# EAGLE design wctl_wifi (EAGLE 9.6.2)
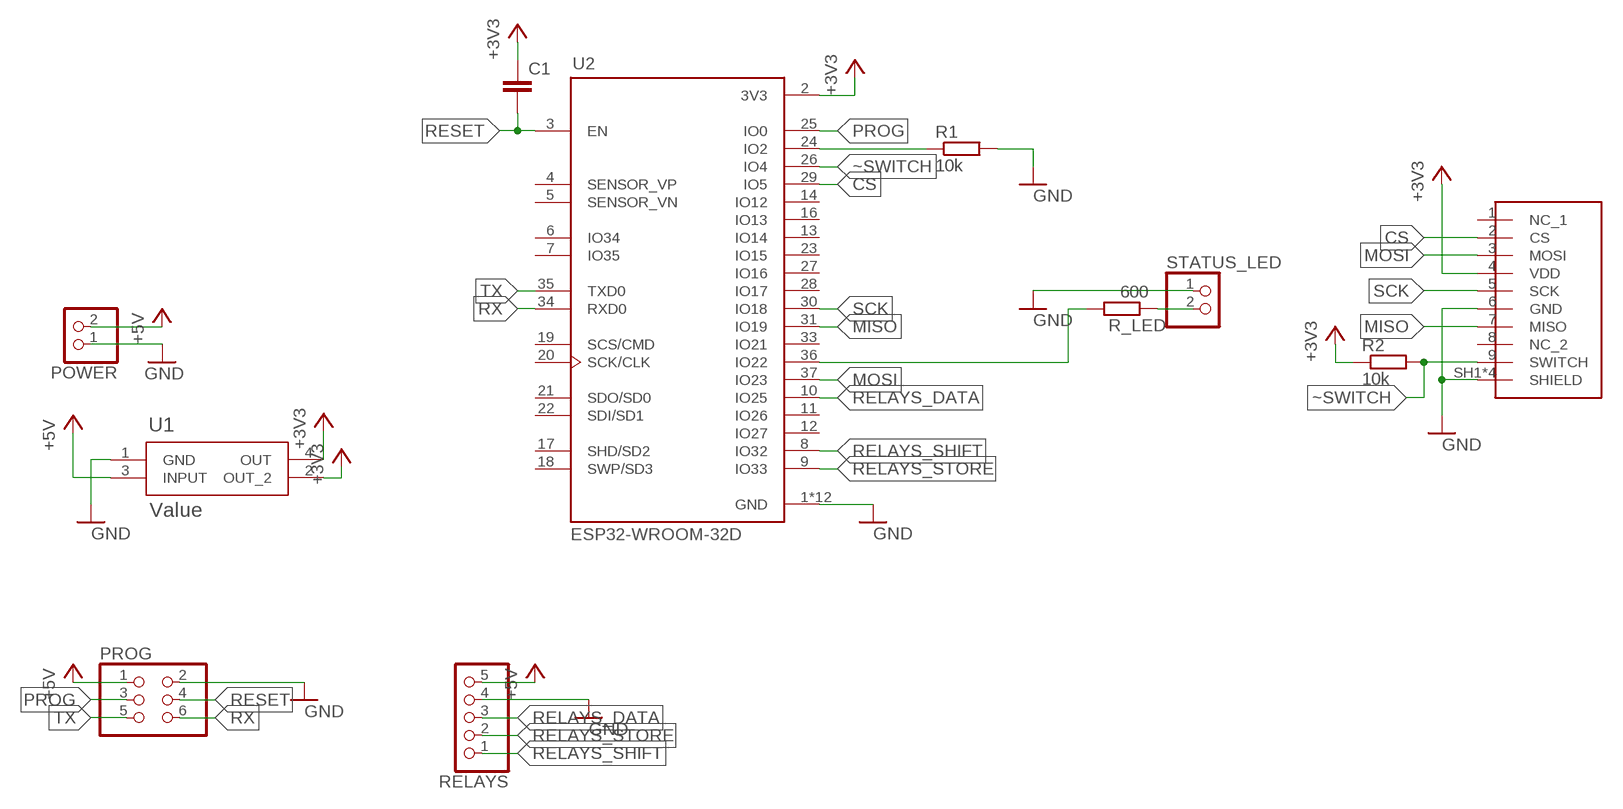
[diagram p0: schematic, sheet 1]

## Parts
C1  C-EUC0603  [C0603]
POWER  PINHD-1X2  [1X02]
PROG  PINHD-2X3  [2X03]
R1  10k  R-EU_R0603  [R0603]
R2  10k  R-EU_R0603  [R0603]
R_LED  600  R-EU_R0603  [R0603]
RELAYS  PINHD-1X5  [1X05]
STATUS_LED  PINHD-1X2  [1X02]
U1  Value  LM1117MPX-ADJ/NOPBDCY0004A_M  [DCY0004A_M]
U2  ESP32-WROOM-32D  [MODULE_ESP32-WROOM-32D]
U$1  SD_SLOT  [SD_SLOT]

## Nets
+3V3: C1.1 R2.1 U1.2(OUT_2) U1.4(OUT) U2.2(3V3) U$1.4(VDD)
+5V: POWER.2 PROG.1 RELAYS.5 U1.3(INPUT)
CS: U2.29(IO5) U$1.2(CS)
GND: POWER.1 PROG.2 R1.2 RELAYS.4 STATUS_LED.1 U1.1(GND) U2.1(GND) U2.15(GND) U2.38(GND) U2.39_1(GND) U2.39_2(GND) U2.39_3(GND) U2.39_4(GND) U2.39_5(GND) U2.39_6(GND) U2.39_7(GND) U2.39_8(GND) U2.39_9(GND) U$1.6(GND) U$1.SH1(SHIELD) U$1.SH2(SHIELD) U$1.SH3(SHIELD) U$1.SH4(SHIELD)
MISO: U2.31(IO19) U$1.7(MISO)
MOSI: U2.37(IO23) U$1.3(MOSI)
N$1: R_LED.1 STATUS_LED.2
N$2: R_LED.2 U2.36(IO22)
N$3: R1.1 U2.24(IO2)
PROG: PROG.3 U2.25(IO0)
RELAYS_DATA: RELAYS.3 U2.10(IO25)
RELAYS_SHIFT: RELAYS.1 U2.8(IO32)
RELAYS_STORE: RELAYS.2 U2.9(IO33)
RESET: C1.2 PROG.4 U2.3(EN)
RX: PROG.6 U2.34(RXD0)
SCK: U2.30(IO18) U$1.5(SCK)
TX: PROG.5 U2.35(TXD0)
~SWITCH: R2.2 U2.26(IO4) U$1.9(SWITCH)
Unconnected: U2.4(SENSOR_VP) U2.5(SENSOR_VN) U2.6(IO34) U2.7(IO35) U2.11(IO26) U2.12(IO27) U2.13(IO14) U2.14(IO12) U2.16(IO13) U2.17(SHD/SD2) U2.18(SWP/SD3) U2.19(SCS/CMD) U2.20(SCK/CLK) U2.21(SDO/SD0) U2.22(SDI/SD1) U2.23(IO15) U2.27(IO16) U2.28(IO17) U2.33(IO21) U$1.1(NC_1) U$1.8(NC_2)

## Library data of the parts
C1 = rcl:C-EU: CAPACITOR, European symbol; SPICEPREFIX: C
POWER STATUS_LED = pinhead:PINHD-1X2: PIN HEADER
PROG = pinhead:PINHD-2X3: PIN HEADER
R1 R2 R_LED = rcl:R-EU_: RESISTOR, European symbol; SPICEPREFIX: R
RELAYS = pinhead:PINHD-1X5: PIN HEADER
U1 = lm1117:LM1117MPX-ADJ/NOPB; MANUFACTURER: Texas Instruments; PARTNUMBER: LM1117IMP-3.3/NOPB; REFDES: RefDes; TYPE: TYPE
U2 = ESP32-WROOM-32D:ESP32-WROOM-32D: Bluetooth, WiFi 802.11b/g/n, Bluetooth v4.2 + EDR, Class 1, 2 and 3 Transceiver Module 2.4GHz ~ 2.5GHz Integrated, Trace Surface Mount Check availability <https://pricing.snapeda.com/parts/ESP32-WROOM-32D/Espressif%20Systems/view-part?ref=eda>; AVAILABILITY: In Stock; DESCRIPTION: Bluetooth, WiFi 802.11b/g/n, Bluetooth v4.2 +EDR, Class 1, 2 and 3 Transceiver Module 2.4GHz ~ 2.5GHz Integrated; MF: Espressif Systems; MP: ESP32-WROOM-32D; PACKAGE: Module Espressif Systems; PRICE: None; PURCHASE-URL: https://pricing.snapeda.com/search/part/ESP32-WROOM-32D/?ref=eda
U$1 = sd_slot:SD_SLOT

## Board
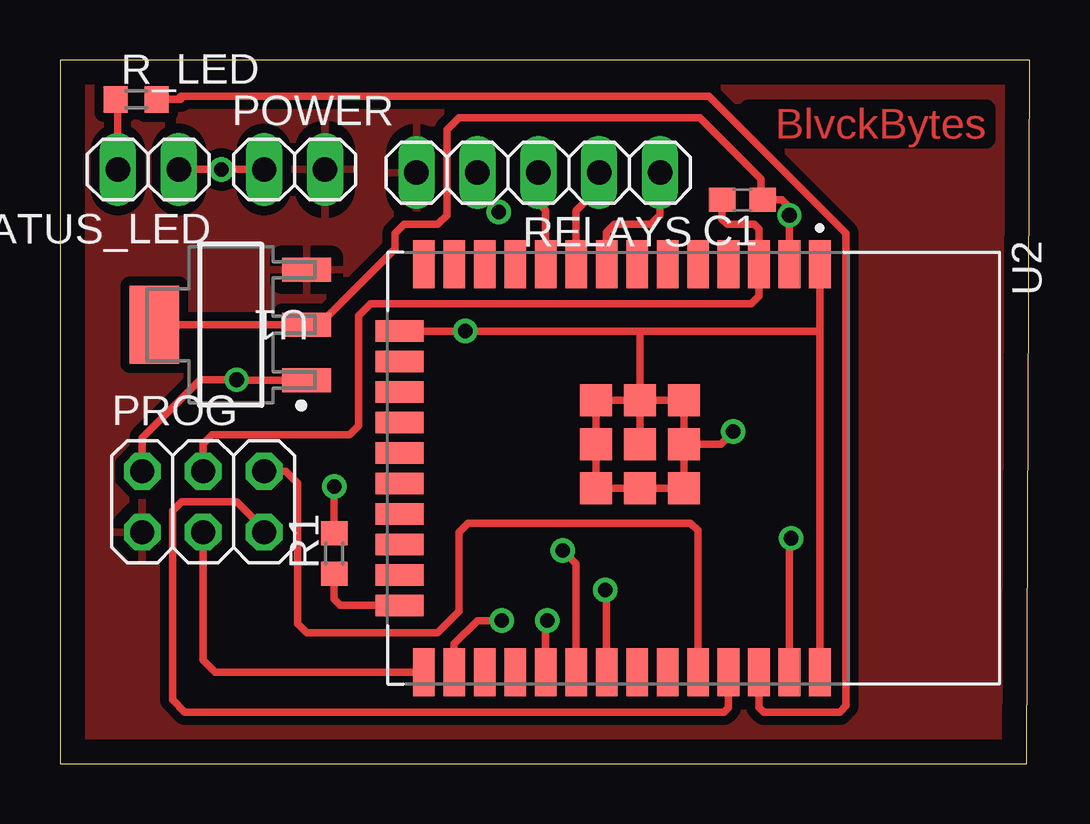
[diagram p1: board, top side]
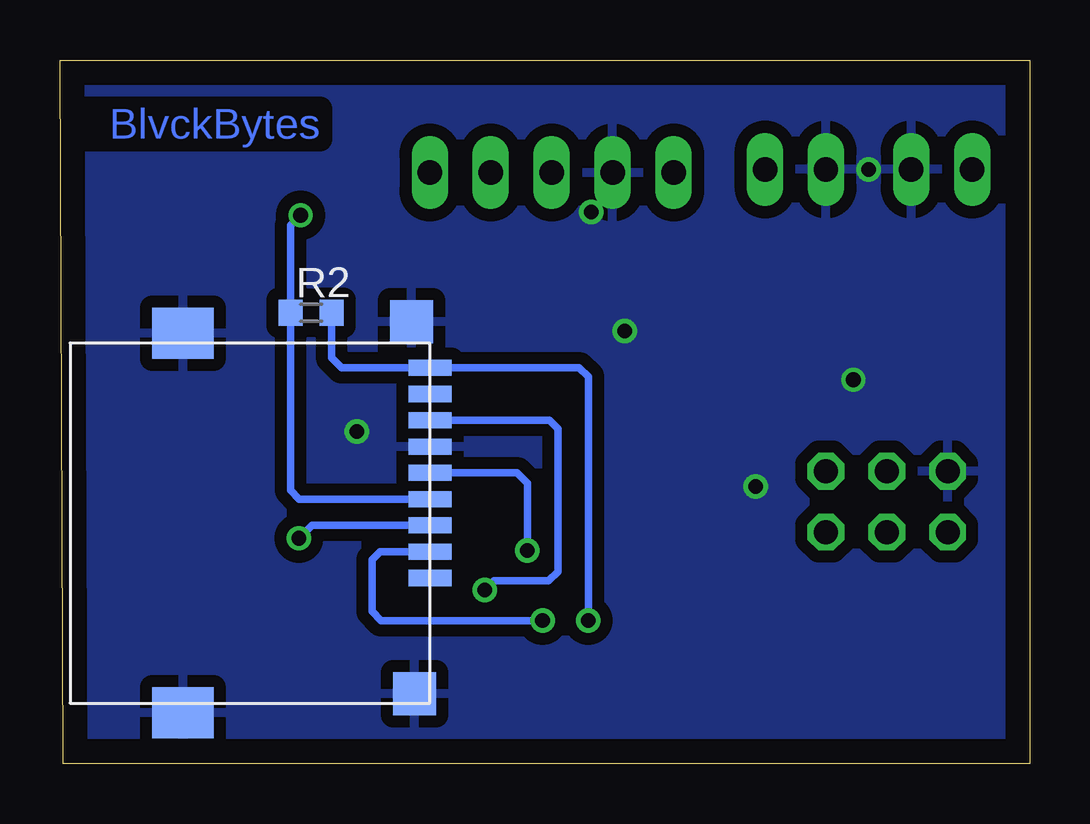
[diagram p2: board, bottom side, seen from below]

Size 40.44 x 29.33 mm. Coordinates in mm from the lower left corner, seen from the top.
Outline: 0,0 40.31,0 40.44,29.33 0,29.33 0,0
Copper layers (1*16): Top 0.035mm / dielectric 1.5mm / Bottom 0.035mm
Design rules "default *": minimum track width 6mil, minimum drill 0.35mm, track to track 6mil, track to pad 6mil, pad to pad 6mil, via to via 6mil, smd to smd 6mil, copper to edge 40mil, drill to drill 6mil, minimum pad ring 10mil, minimum via ring 8mil, stop-mask expansion 4mil, vias tented up to drill 0mil, thermal gap 20mil

### Footprints (pad centres in the part's own frame; a part is rotated, then mirrored left to right if it is on the bottom)
C0603 = smd 1.1 x 1: 1 -0.85,0; 2 0.85,0
1X02 = drill 1.016 long: 1 -1.27,0; 2 1.27,0
2X03 = drill 1.016 octagon: 1 -2.54,-1.27; 2 -2.54,1.27; 3 0,-1.27; 4 0,1.27; 5 2.54,-1.27; 6 2.54,1.27
R0603 = smd 1 x 1.1: 1 -0.85,0; 2 0.85,0
1X05 = drill 1.016 long: 1 -5.08,0; 2 -2.54,0; 3 0,0; 4 2.54,0; 5 5.08,0
DCY0004A_M = smd 2.05 x 1: 1 -3.175,2.3; 2 -3.175,0; 3 -3.175,-2.3 | smd 2.05 x 3.25: 4 3.175,0
MODULE_ESP32-WROOM-32D = smd 2 x 0.9: 1 -8.5,5.26; 2 -8.5,3.99; 3 -8.5,2.72; 4 -8.5,1.45; 5 -8.5,0.18; 6 -8.5,-1.09; 7 -8.5,-2.36; 8 -8.5,-3.63; 9 -8.5,-4.9; 10 -8.5,-6.17; 11 -8.5,-7.44; 12 -8.5,-8.71; 13 -8.5,-9.98; 14 -8.5,-11.25; 25 8.5,-11.25; 26 8.5,-9.98; 27 8.5,-8.71; 28 8.5,-7.44; 29 8.5,-6.17; 30 8.5,-4.9; 31 8.5,-3.63; 32 8.5,-2.36; 33 8.5,-1.09; 34 8.5,0.18; 35 8.5,1.45; 36 8.5,2.72; 37 8.5,3.99; 38 8.5,5.26 | smd 0.9 x 2: 15 -5.715,-12.25; 16 -4.445,-12.25; 17 -3.175,-12.25; 18 -1.905,-12.25; 19 -0.635,-12.25; 20 0.635,-12.25; 21 1.905,-12.25; 22 3.175,-12.25; 23 4.445,-12.25; 24 5.715,-12.25 | smd 1.33 x 1.33: 39_1 -2.835,-0.405; 39_2 -1,-0.405; 39_3 0.835,-0.405; 39_4 -2.835,-2.24; 39_5 -1,-2.24; 39_6 0.835,-2.24; 39_7 -2.835,-4.075; 39_8 -1,-4.075; 39_9 0.835,-4.075
SD_SLOT = smd 0.673 x 1.804: 1 -2.291,-7.5; 2 -1.195,-7.5; 3 -0.085,-7.5; 4 0.995,-7.5; 5 2.091,-7.5; 6 3.186,-7.5; 7 4.281,-7.5; 8 5.377,-7.5; 9 6.472,-7.5 | smd 1.8 x 1.8: SH1 -7.113,-6.856; SH4 8.382,-6.731 | smd 2.126 x 2.577: SH2 -7.9,2.8; SH3 7.9,2.8

### Placement (x,y rotation side)
C1  28.45,23.49 180 top
POWER  9.78,24.77 0 top
PROG  5.97,10.92 0 top
R1  11.43,8.76 90 top
R2  29.97,18.8 0 bottom
R_LED  3.17,27.69 0 top
RELAYS  19.94,24.64 180 top
STATUS_LED  3.68,24.77 180 top
U1  7.11,18.29 180 top
U2  26.42,12.32 270 top
U$1  32.51,10.03 90 bottom

### Tracks (layer width: path | path; a pad name or v marks a point on that pad's centre or on a via)
+3V3  (via drill 0.61 pad 1.02)
  Top 0.305: U1.4 U1.2 10.79,18.29 13.97,21.46 13.97,22.1 14.35,22.48 15.75,22.48 16.13,22.86 16.13,26.42 16.64,26.92 26.67,26.92 29.21,24.38 29.21,23.49 C1.1 30.1,23.49 30.41,23.19 v30.41,22.86 U2.2
  Bottom 0.305: U$1.4 30.46,11.03 30.82,11.39 R2.1 30.82,22.44 v30.41,22.86
+5V
  pour Top (isolate 0.381): -0.38,29.46 -0.38,0 40.51,0 40.51,29.34 40.64,29.46
CS  (via drill 0.61 pad 1.02)
  Top 0.305: U2.29 20.25,5.64 20.32,5.71 v20.32,5.97
  Bottom 0.305: U$1.2 27.1,8.84 27.43,8.51 27.43,6.35 27.05,5.97 v20.32,5.97
GND  (via drill 0.61, 0.61 pad 1.02)
  Top 0.305: 10.27,16 U1.1 | STATUS_LED.1 v6.73,24.77 POWER.1 | U2.39_4 U2.39_7 22.35,15.16 | U2.39_4 U2.39_1 U2.39_2 | U2.39_2 U2.39_3 U2.39_6 U2.39_9 U2.39_8 22.34,14.99 | U2.39_4 U2.39_5 | 13.97,18.23 U2.15 v16.89,18.03 24.13,18.03 | 10.3,16 U1.1 | U1.1 v7.38,15.99 v7.37,16 5.84,16 3.43,13.59 PROG.2 | RELAYS.4 17.4,23.88 v18.29,22.99 | R1.2 v11.43,11.56 | 24.13,18.03 31.62,18.03 31.68,18.09 | 31.68,18.09 U2.1 | U2.39_4 24.18,17.99 24.13,18.03 | 31.68,18.09 U2.38 | U2.39_2 27.54,13.32 v28.07,13.84
  pour Bottom (isolate 0.508): -0.38,29.72 -0.38,-0.76 40.26,-0.76 40.26,29.72
MISO  (via drill 0.61 pad 1.02)
  Top 0.305: U2.31 22.79,7.19 v22.73,7.24
  Bottom 0.305: U$1.7 20.03,14.31 19.69,13.97 19.69,8 20.07,7.62 22.35,7.62 v22.73,7.24
MOSI  (via drill 0.61 pad 1.02)
  Top 0.305: U2.37 30.41,9.32 v30.48,9.4
  Bottom 0.305: v30.48,9.4 29.93,9.95 U$1.3
N$1
  Top 0.305: STATUS_LED.2 2.41,27.6 R_LED.1
N$2
  Top 0.305: R_LED.2 5.04,27.69 5.04,27.81 27.05,27.81 32.77,22.1 32.77,2.41 32.51,2.16 29.34,2.16 29.14,2.36 U2.36
N$3
  Top 0.305: R1.1 11.43,6.86 11.68,6.6 U2.24
PROG
  Top 0.305: PROG.3 5.97,4.32 6.47,3.82 U2.25
RELAYS_DATA
  Top 0.305: U2.10 20.25,23.06 19.94,23.37 RELAYS.3
RELAYS_SHIFT
  Top 0.305: U2.8 22.79,22.15 23.11,22.48 24.64,22.48 25.02,22.86 RELAYS.1
RELAYS_STORE
  Top 0.305: U2.9 21.52,23.04 22.48,24 RELAYS.2
RESET
  Top 0.305: PROG.4 5.97,13.34 6.35,13.72 12.06,13.72 12.45,14.1 12.45,18.67 12.95,19.18 28.83,19.18 29.14,19.48 U2.3 29.14,22.3 28.96,22.48 27.81,22.48 27.6,22.69 C1.2
RX
  Top 0.305: PROG.6 9.4,12.19 9.91,11.68 9.91,5.84 10.29,5.46 15.75,5.46 16.64,6.35 16.64,9.65 17.02,10.03 26.29,10.03 26.6,9.73 U2.34
SCK  (via drill 0.61 pad 1.02)
  Top 0.305: U2.30 21.52,8.33 v20.95,8.89
  Bottom 0.305: v20.95,8.89 20.95,11.68 21.4,12.12 U$1.5
TX
  Top 0.305: PROG.5 8.64,9.65 7.37,10.92 5.08,10.92 4.7,10.54 4.7,2.67 5.21,2.16 27.69,2.16 27.87,2.34 U2.35
~SWITCH  (via drill 0.61 pad 1.02)
  Top 0.305: U2.26 16.44,5.01 17.4,5.97 v18.41,5.97
  Bottom 0.305: U$1.9 25.27,16.5 | 25.27,16.5 28.7,16.5 29.12,16.93 R2.2 | v18.41,5.97 18.41,16.13 18.8,16.51 25.27,16.51 25.27,16.5

### Text on the board
Top: BlvckBytes
Bottom: BlvckBytes